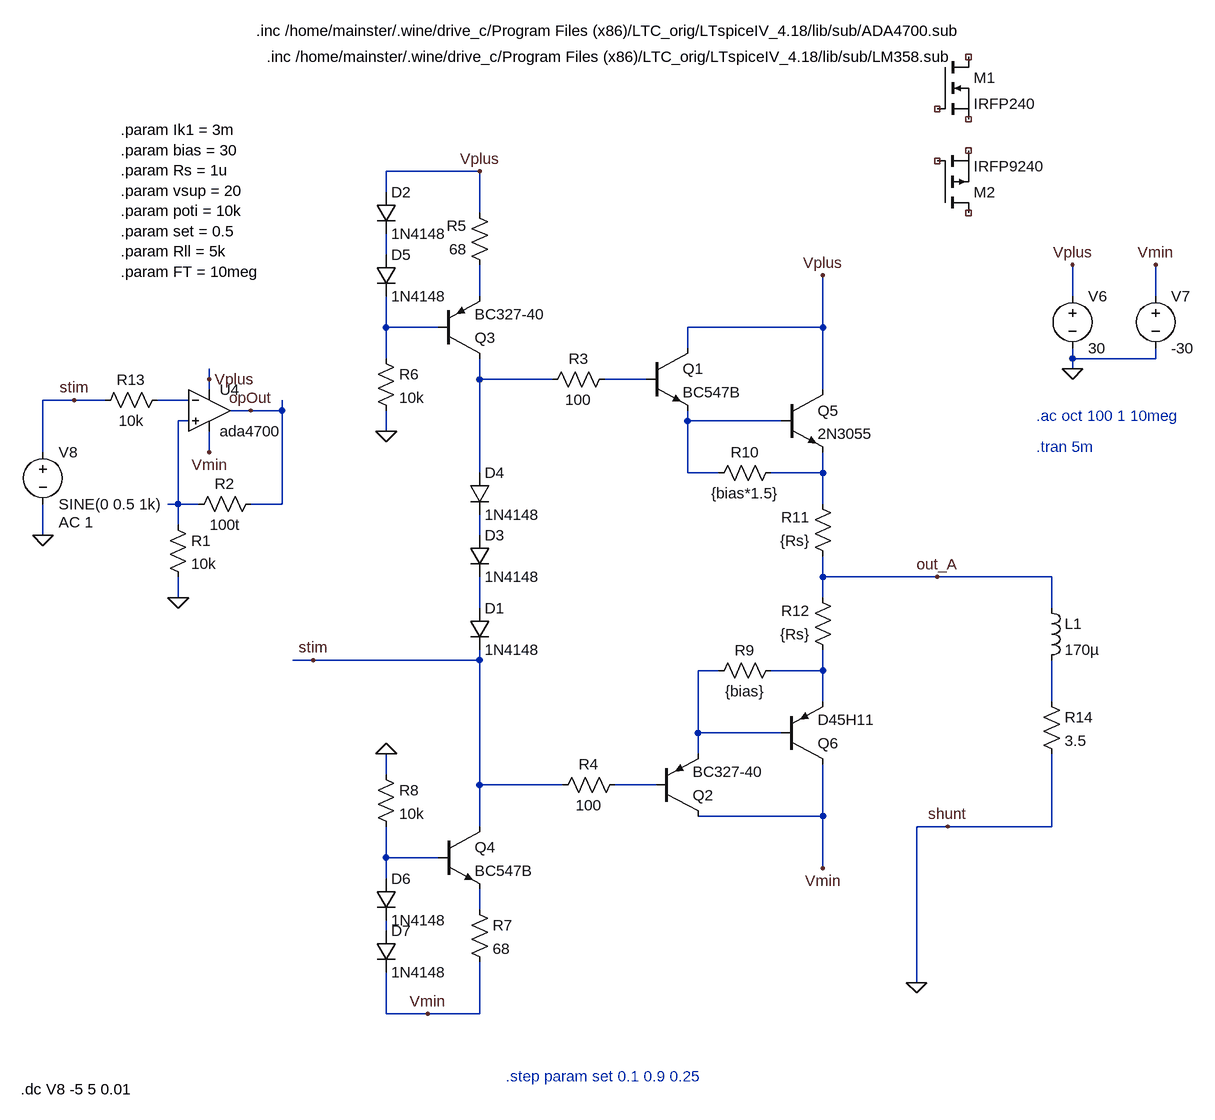
[diagram p0: schematic Endstufe_tietze_s895.asc]
Endstufe_tietze_s895.asc, the LTspice schematic file:
Version 4
SHEET 1 4408 6248
WIRE 1136 -320 992 -320
WIRE 992 -288 992 -320
WIRE 1136 -256 1136 -320
WIRE 992 -192 992 -224
WIRE 1136 -128 1136 -176
WIRE 2048 -128 2048 -176
WIRE 2176 -128 2176 -176
WIRE 992 -80 992 -128
WIRE 1072 -80 992 -80
WIRE 1664 -80 1664 -160
WIRE 1664 -80 1456 -80
WIRE 1456 -48 1456 -80
WIRE 992 -32 992 -80
WIRE 2048 -32 2048 -48
WIRE 2176 -32 2176 -48
WIRE 2176 -32 2048 -32
WIRE 2048 -16 2048 -32
WIRE 720 0 720 -16
WIRE 1136 0 1136 -32
WIRE 1248 0 1136 0
WIRE 1392 0 1328 0
WIRE 720 16 720 0
WIRE 1664 16 1664 -80
WIRE 512 32 464 32
WIRE 560 32 512 32
WIRE 688 32 640 32
WIRE 784 48 752 48
WIRE 832 48 832 32
WIRE 832 48 784 48
WIRE 688 64 672 64
WIRE 1456 64 1456 48
WIRE 1600 64 1456 64
WIRE 992 80 992 48
WIRE 464 112 464 32
WIRE 720 112 720 80
WIRE 1136 144 1136 0
WIRE 1456 144 1456 64
WIRE 1504 144 1456 144
WIRE 1664 144 1664 112
WIRE 1664 144 1584 144
WIRE 672 192 672 64
WIRE 672 192 656 192
WIRE 704 192 672 192
WIRE 832 192 832 48
WIRE 832 192 784 192
WIRE 1664 192 1664 144
WIRE 672 224 672 192
WIRE 464 240 464 192
WIRE 1136 240 1136 208
WIRE 1664 304 1664 272
WIRE 1840 304 1664 304
WIRE 2016 304 1840 304
WIRE 672 336 672 304
WIRE 1664 336 1664 304
WIRE 1136 352 1136 304
WIRE 2016 352 2016 304
WIRE 880 432 848 432
WIRE 1136 432 1136 416
WIRE 1136 432 880 432
WIRE 1504 448 1472 448
WIRE 1664 448 1664 416
WIRE 1664 448 1584 448
WIRE 1664 496 1664 448
WIRE 2016 496 2016 432
WIRE 1472 544 1472 448
WIRE 1600 544 1472 544
WIRE 1472 576 1472 544
WIRE 992 608 992 576
WIRE 1136 624 1136 432
WIRE 1264 624 1136 624
WIRE 1408 624 1344 624
WIRE 1664 672 1664 592
WIRE 1664 672 1472 672
WIRE 1136 688 1136 624
WIRE 1856 688 1808 688
WIRE 2016 688 2016 576
WIRE 2016 688 1856 688
WIRE 992 736 992 688
WIRE 1072 736 992 736
WIRE 1664 752 1664 672
WIRE 992 768 992 736
WIRE 1136 816 1136 784
WIRE 992 848 992 832
WIRE 1808 928 1808 688
WIRE 992 976 992 912
WIRE 1056 976 992 976
WIRE 1136 976 1136 896
WIRE 1136 976 1056 976
FLAG 2048 -16 0
FLAG 2048 -176 Vplus
FLAG 2176 -176 Vmin
FLAG 464 240 0
FLAG 720 0 Vplus
FLAG 720 112 Vmin
FLAG 1664 -160 Vplus
FLAG 1664 752 Vmin
FLAG 1840 304 out_A
FLAG 1856 688 shunt
FLAG 512 32 stim
FLAG 784 48 opOut
FLAG 672 336 0
FLAG 992 80 0
FLAG 992 576 0
FLAG 1056 976 Vmin
FLAG 1136 -320 Vplus
FLAG 880 432 stim
FLAG 1808 928 0
SYMBOL voltage 2048 -144 R0
WINDOW 123 0 0 Left 2
WINDOW 39 0 0 Left 2
SYMATTR InstName V6
SYMATTR Value 30
SYMBOL voltage 2176 -144 R0
WINDOW 123 0 0 Left 2
WINDOW 39 0 0 Left 2
SYMATTR InstName V7
SYMATTR Value -30
SYMBOL voltage 464 96 R0
WINDOW 123 24 124 Left 2
WINDOW 39 0 0 Left 2
SYMATTR Value2 AC 1
SYMATTR InstName V8
SYMATTR Value SINE(0 0.5 1k)
SYMBOL diode 1120 352 R0
SYMATTR InstName D1
SYMATTR Value 1N4148
SYMBOL npn 1392 -48 R0
SYMATTR InstName Q1
SYMATTR Value BC547B
SYMBOL pnp 1408 672 M180
SYMATTR InstName Q2
SYMATTR Value BC327-40
SYMBOL nmos 1840 -496 R0
SYMATTR InstName M1
SYMATTR Value IRFP240
SYMBOL pmos 1840 -256 M180
SYMATTR InstName M2
SYMATTR Value IRFP9240
SYMBOL res 1600 432 R90
WINDOW 0 0 56 VBottom 2
WINDOW 3 32 56 VTop 2
SYMATTR InstName R9
SYMATTR Value {bias}
SYMBOL res 1600 128 R90
WINDOW 0 0 56 VBottom 2
WINDOW 3 32 56 VTop 2
SYMATTR InstName R10
SYMATTR Value {bias*1.5}
SYMBOL res 1680 288 R180
WINDOW 0 36 76 Left 2
WINDOW 3 36 40 Left 2
SYMATTR InstName R11
SYMATTR Value {Rs}
SYMBOL res 1680 432 R180
WINDOW 0 36 76 Left 2
WINDOW 3 36 40 Left 2
SYMATTR InstName R12
SYMATTR Value {Rs}
SYMBOL res 544 48 R270
WINDOW 0 32 56 VTop 2
WINDOW 3 0 56 VBottom 2
SYMATTR InstName R13
SYMATTR Value 10k
SYMBOL res 2000 480 R0
SYMATTR InstName R14
SYMATTR Value 3.5
SYMBOL ind 2000 336 R0
SYMATTR InstName L1
SYMATTR Value 170µ
SYMBOL Opamps\\opamp2 720 -16 R0
SYMATTR InstName U4
SYMATTR Value ada4700
SYMATTR SpiceModel ada4700
SYMBOL res 656 208 R0
SYMATTR InstName R1
SYMATTR Value 10k
SYMBOL res 800 176 R90
WINDOW 0 0 56 VBottom 2
WINDOW 3 32 56 VTop 2
SYMATTR InstName R2
SYMATTR Value 100t
SYMBOL diode 1120 240 R0
SYMATTR InstName D3
SYMATTR Value 1N4148
SYMBOL diode 1120 144 R0
SYMATTR InstName D4
SYMATTR Value 1N4148
SYMBOL res 1344 -16 R90
WINDOW 0 0 56 VBottom 2
WINDOW 3 32 56 VTop 2
SYMATTR InstName R3
SYMATTR Value 100
SYMBOL res 1360 608 R90
WINDOW 0 0 56 VBottom 2
WINDOW 3 32 56 VTop 2
SYMATTR InstName R4
SYMATTR Value 100
SYMBOL res 1152 -160 R180
WINDOW 0 36 76 Left 2
WINDOW 3 36 40 Left 2
SYMATTR InstName R5
SYMATTR Value 68
SYMBOL pnp 1072 -32 M180
SYMATTR InstName Q3
SYMATTR Value BC327-40
SYMBOL res 976 -48 R0
SYMATTR InstName R6
SYMATTR Value 10k
SYMBOL npn 1072 688 R0
SYMATTR InstName Q4
SYMATTR Value BC547B
SYMBOL res 1120 800 R0
SYMATTR InstName R7
SYMATTR Value 68
SYMBOL res 976 592 R0
SYMATTR InstName R8
SYMATTR Value 10k
SYMBOL diode 976 -288 R0
SYMATTR InstName D2
SYMATTR Value 1N4148
SYMBOL diode 976 -192 R0
SYMATTR InstName D5
SYMATTR Value 1N4148
SYMBOL diode 976 768 R0
SYMATTR InstName D6
SYMATTR Value 1N4148
SYMBOL diode 976 848 R0
SYMATTR InstName D7
SYMATTR Value 1N4148
SYMBOL npn 1600 16 R0
SYMATTR InstName Q5
SYMATTR Value 2N3055
SYMBOL pnp 1600 592 M180
SYMATTR InstName Q6
SYMATTR Value D45H11
TEXT 792 -536 Left 2 !.inc /home/mainster/.wine/drive_c/Program Files (x86)/LTC_orig/LTspiceIV_4.18/lib/sub/ADA4700.sub
TEXT 808 -496 Left 2 !.inc /home/mainster/.wine/drive_c/Program Files (x86)/LTC_orig/LTspiceIV_4.18/lib/sub/LM358.sub
TEXT 584 -384 Left 2 !.param Ik1 = 3m\n.param bias = 30\n.param Rs = 1u\n.param vsup = 20\n.param poti = 10k\n.param set = 0.5\n.param Rll = 5k\n.param FT = 10meg
TEXT 1176 1072 Left 2 ;.step param set 0.1 0.9 0.25
TEXT 1992 56 Left 2 ;.ac oct 100 1 10meg
TEXT 1992 104 Left 2 ;.tran 5m
TEXT 430 1092 Left 2 !.dc V8 -5 5 0.01

The netlist it stands for:
* Endstufe_tietze_s895.asc
V6 Vplus 0 30
V7 Vmin 0 -30
V8 stim 0 SINE(0 0.5 1k) AC 1
D1 N011 stim 1N4148
Q1 Vplus N005 N008 0 BC547B
Q2 Vmin N015 N012 0 BC327-40
M1 NC_01 NC_02 NC_03 NC_03 IRFP240
M2 NC_04 NC_05 NC_06 NC_06 IRFP9240
R9 N013 N012 {bias}
R10 N009 N008 {bias*1.5}
R11 out_A N009 {Rs}
R12 N013 out_A {Rs}
R13 stim N006 10k
R14 N014 0 3.5
L1 out_A N014 170µ
XU4 N007 N006 Vplus Vmin opOut ada4700 ada4700  ; pins In+ In- V+ V- OUT
R1 N007 0 10k
R2 opOut N007 100t
D3 N010 N011 1N4148
D4 N004 N010 1N4148
R3 N005 N004 100
R4 N015 stim 100
R5 N002 Vplus 68
Q3 N004 N003 N002 0 BC327-40
R6 N003 0 10k
Q4 stim N016 N017 0 BC547B
R7 N017 Vmin 68
R8 0 N016 10k
D2 Vplus N001 1N4148
D5 N001 N003 1N4148
D6 N016 N018 1N4148
D7 N018 Vmin 1N4148
Q5 Vplus N008 N009 0 2N3055
Q6 Vmin N012 N013 0 D45H11
.model D D
.lib standard.dio
.model NPN NPN
.model PNP PNP
.lib standard.bjt
.model NMOS NMOS
.model PMOS PMOS
.lib standard.mos
.inc /home/mainster/.wine/drive_c/Program Files (x86)/LTC_orig/LTspiceIV_4.18/lib/sub/ADA4700.sub
.inc /home/mainster/.wine/drive_c/Program Files (x86)/LTC_orig/LTspiceIV_4.18/lib/sub/LM358.sub
.param Ik1 = 3m
.param bias = 30
.param Rs = 1u
.param vsup = 20
.param poti = 10k
.param set = 0.5
.param Rll = 5k
.param FT = 10meg
* .step param set 0.1 0.9 0.25
* .ac oct 100 1 10meg
* .tran 5m
.dc V8 -5 5 0.01
.backanno
.end